# Altium schematic sheet MP2019_LDO_5V.SchDoc: MP2019_LDO_5V@300mA
size A4; Author: Andrés Gullón; DocumentNumber: 3; SheetNumber: 3; SheetTotal: 9
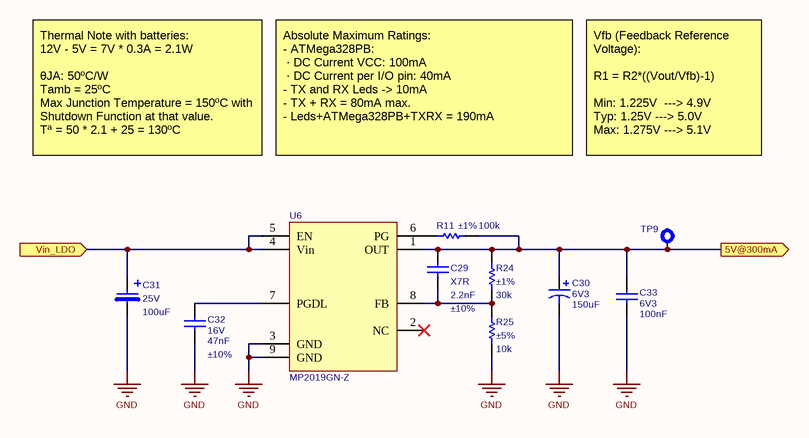
[diagram p0: MP2019_LDO_5V.SchDoc]

## Parts
C29  Dielectric: X7R  Capacitance: 2.2nF  Tolerance: ±10%  [C0402]  (hidden comment: C0402_2.2nF_16V_±10%)
C30  Voltage: 6V3  Capacitance: 150uF  [CASE_B_3528-1411]  (hidden comment: 150uF_6V3_±20%)
C31  Voltage: 25V  Capacitance: 100uF  [CASE_D_7.7]  (hidden comment: Cap_Al_100uF_25V)
C32  Voltage: 16V  Capacitance: 47nF  Tolerance: ±10%  [C0402]  (hidden comment: C0402_47nF_16V_±10%)
C33  Voltage: 6V3  Capacitance: 100nF  [C0402]  (hidden comment: C0402_100nF_6V3_±10%)
R11  Tolerance: ±1%  Resistance: 100k  [R0402]  (hidden comment: R0402_100k_0.063W_±1%)
R24  Tolerance: ±1%  Resistance: 30k  [R0402]  (hidden comment: R0402_30k_0.063W_±1%)
R25  Tolerance: ±5%  Resistance: 10k  [R0402]  (hidden comment: R0402_10k_0.063W_±5%)
TP9  TP  [TP_POWER]  (value not drawn)  (no BOM)
U6  MP2019GN-Z  [SOIC8 EP]

## Ports
5V@300mA (out), Vin_LDO (in)

## Nets
GND: C30.2 C31.2 C32.1 C33.1 R25.2 U6.3(GND) U6.9(GND)
5V@300mA: C29.1 C30.1 C33.2 R11.1 R24.2 TP9.1 U6.1(OUT) ; port 5V@300mA
Vin_LDO: C31.1 U6.4(Vin) U6.5(EN) ; port Vin_LDO
NetC29_2: C29.2 R24.1 R25.1 U6.8(FB)
NetC32_2: C32.2 U6.7(PGDL)
NetR11_2: R11.2 U6.6(PG)

Not connected (* = marked no-connect by the designer): U6 2(NC)*

## Notes on the sheet
- Thermal Note with batteries:
  12V - 5V = 7V * 0.3A = 2.1W
  θJA: 50ºC/W
  Tamb = 25ºC
  Max Junction Temperature = 150ºC with Shutdown Function at that value.
  Tª = 50 * 2.1 + 25 = 130ºC
- Absolute Maximum Ratings:
  - ATMega328PB:
  · DC Current VCC: 100mA
  · DC Current per I/O pin: 40mA
  - TX and RX Leds -> 10mA
  - TX + RX = 80mA max.
  - Leds+ATMega328PB+TXRX = 190mA
- Vfb (Feedback Reference Voltage):
  R1 = R2*((Vout/Vfb)-1)
  Min: 1.225V  ---> 4.9V
  Typ: 1.25V ---> 5.0V
  Max: 1.275V ---> 5.1V
- Title
- Project
- Size:
- Author
- A4
- Number:
- Revision:
- Mundo Reader, S.L. This project and all the sheets and layouts enclosed are licensed under Creative Commons by Attribution and Share Alike [CC BY-SA] (www.creativecommons.com)
- Date:
- Time:
- Sheet
- of

## Library data of the parts
C29 = CMP-A0549-1: Manufacturer: Kemet; Voltage: 16V; Value: 2.2nF ±10% 16V; OrderingCode: C0402C222K4RAC; Temp_ Max: 125; Temp_ Min: -55; SchLibComponentName: Capacitor; Part Number: C0402_2.2nF_16V_±10%; Price units: EUR
C30 = CMP-A2028-1: Manufacturer: Vishay; Value: 150uF ±20% 6V3; Tolerance: ±20%; ESR: 40m; OrderingCode: T55B157M6R3C0040; Temp_ Max: 105; Temp_ Min: -55; SchLibComponentName: Tantalum; Part Number: 150uF_6V3_±20%; Price units: EUR
C31 = CMP-A0618-1: Manufacturer: Panasonic; Value: 100uF 25V; OrderingCode: EEE-HA1E101XP; Temp_ Max: 85; Temp_ Min: -40; SchLibComponentName: Electrolytic; Part Number: Cap_Al_100uF_25V; Price units: EUR
C32 = CMP-A0571-1: Manufacturer: Kemet; Dielectric: X7R; Value: 47nF ±10% 16V; OrderingCode: C0402C473K4RAC; Temp_ Max: 125; Temp_ Min: -55; SchLibComponentName: Capacitor; Part Number: C0402_47nF_16V_±10%; Price units: EUR
C33 = CMP-A0475-1: Manufacturer: Kemet; Dielectric: X7R; Value: 100nF ±10% 6V3; Tolerance: ±10%; OrderingCode: C0402C104K9RAC; Temp_ Max: 125; Temp_ Min: -55; SchLibComponentName: Capacitor; Part Number: C0402_100nF_6V3_±10%; Price units: EUR
R11 = CMP-A1835-1: Manufacturer: Vishay; Value: 100k ±1% 0.063W; OrderingCode: CRCW0402100KFK; Power: 0.063W; Temp_ Max: 155; Temp_ Min: -55; SchLibComponentName: Resistor; PackageDescription: SMD; Part Number: R0402_100k_0.063W_±1%; Price units: EUR
R24 = CMP-A1912-2: Manufacturer: Vishay; Value: 30k ±1% 0.063W; OrderingCode: CRCW040230K0FK; Power: 0.063W; Temp_ Max: 155; Temp_ Min: -55; Description ES: Resistencia; SchLibComponentName: Resistor; PackageDescription: SMD; Part Number: R0402_30k_0.063W_±1%; Price units: EUR
R25 = CMP-A1692-4: Manufacturer: Vishay; Value: 10k ±5% 0.063W; SchLibComponentName: Resistor; OrderingCode: CRCW040210K0JN; Power: 0.063W; Temp_ Max: 155; Temp_ Min: -55; Description ES: Resistencia; OrderingCode 2: RC0402JR-0710KL; Temp_Max: 155°C; Temp_Min: -55°C; PackageDescription: SMD; Part Number: R0402_10k_0.063W_±5%; Price units: EUR; Manufacturer 2: Yageo
TP9 = CMP-A2499-3: Testpoint 0.3mm; Manufacturer: Oxley; OrderingCode: SMOX/060/B1; SAP: 303552; SchLibComponentName: Testpoint; Part Number: TP_POWER; Price units: EUR
U6 = CMP-00392-2: LDO Vin: 3-40V Vout: 1.2-15V @300mA; Manufacturer: Monolithic Power Systems; Temp_Max: 150; Temp_Min: -40; Description ES: LDO Vin: 3-40V Vout: 1.2-15V @300mA; OrderingCode: MP2019GN-Z; Part Number: MP2019GN-Z; SchLibComponentName: MP2019